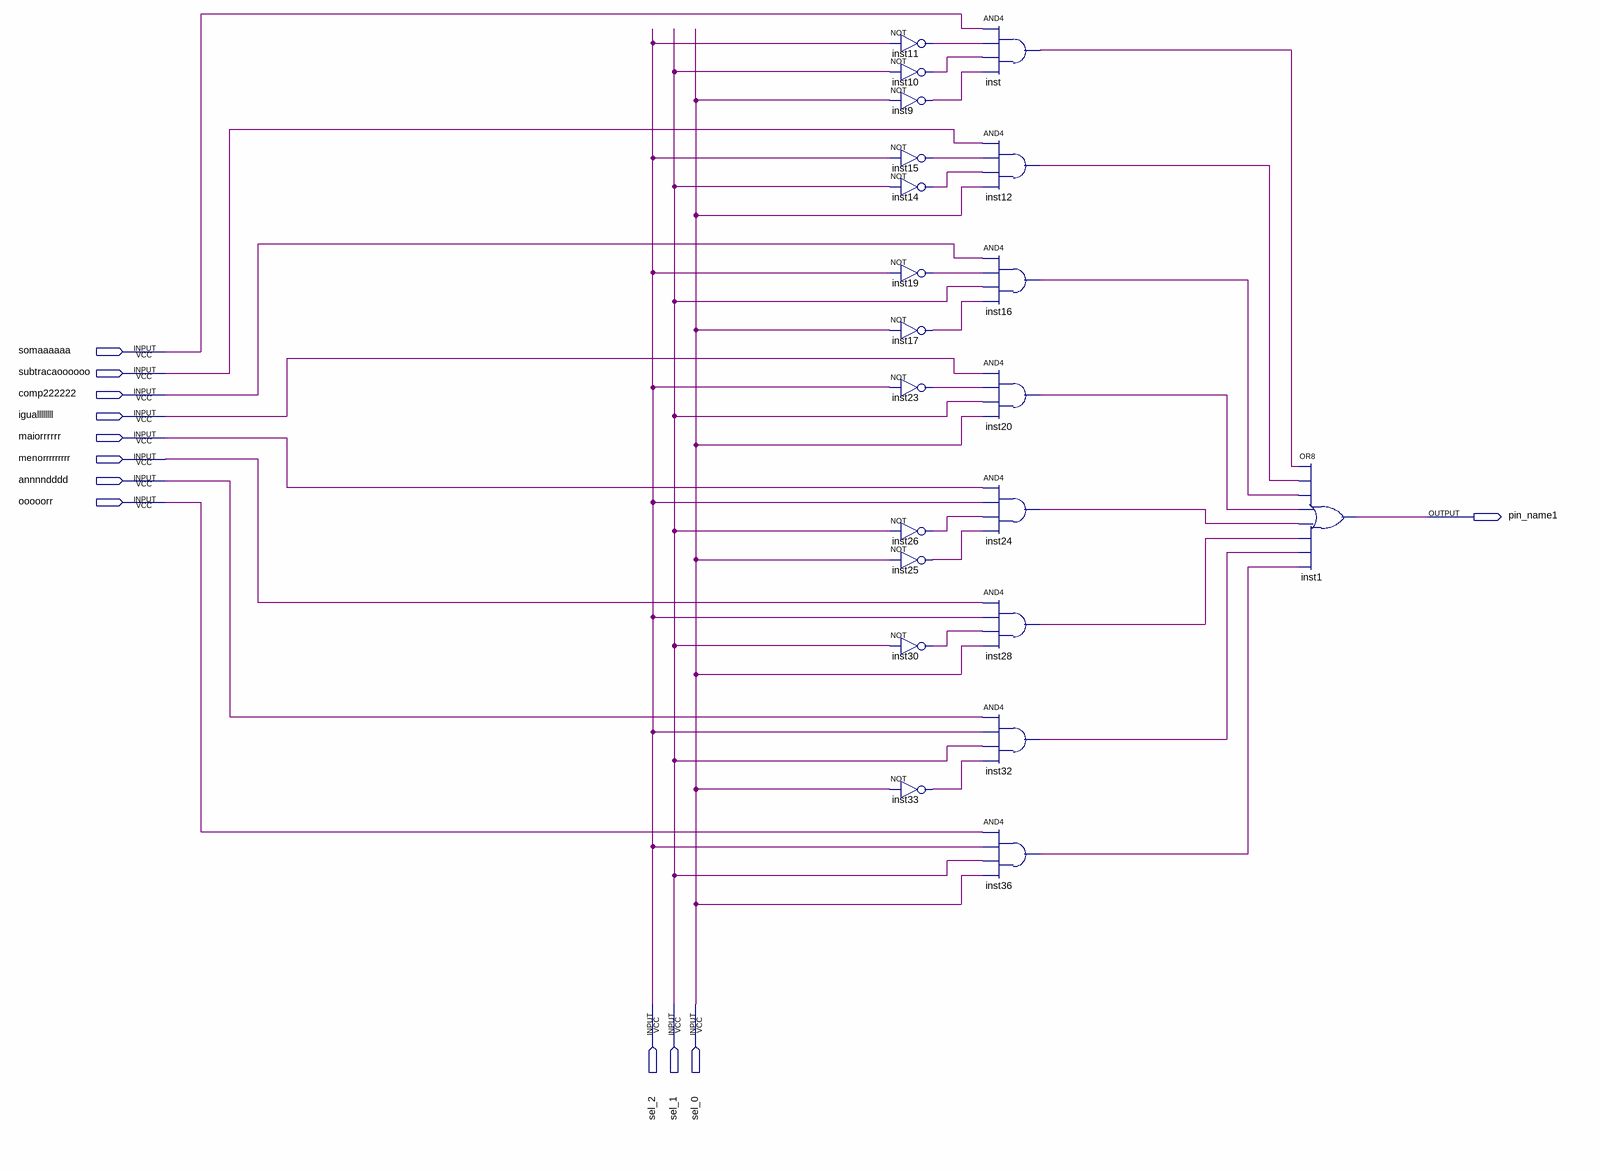
[diagram p0: schematic sheet]
// Quartus schematic mux.bdf as structural Verilog: 21 symbols, 12 pins
module mux (
  input  somaaaaaa,
  input  subtracaoooooo,
  input  comp222222,
  input  iguallllllll,
  input  maiorrrrrr,
  input  menorrrrrrrrr,
  input  annnndddd,
  input  ooooorr,
  input  sel_2,
  input  sel_1,
  input  sel_0,
  output pin_name1
);

  wire inst9_out, inst10_out, inst11_out, inst12_out, inst14_out, inst15_out, inst16_out, inst17_out,
       inst19_out, inst20_out, inst23_out, inst24_out, inst25_out, inst26_out, inst28_out, inst30_out,
       inst32_out, inst33_out, inst36_out, inst_out;

  not inst11 (inst11_out, sel_2);
  not inst10 (inst10_out, sel_1);
  not inst9 (inst9_out, sel_0);
  not inst15 (inst15_out, sel_2);
  not inst14 (inst14_out, sel_1);
  not inst19 (inst19_out, sel_2);
  not inst17 (inst17_out, sel_0);
  not inst23 (inst23_out, sel_2);
  not inst26 (inst26_out, sel_1);
  not inst25 (inst25_out, sel_0);
  not inst30 (inst30_out, sel_1);
  not inst33 (inst33_out, sel_0);
  and inst (inst_out, somaaaaaa, inst11_out, inst10_out, inst9_out);
  and inst12 (inst12_out, subtracaoooooo, inst15_out, inst14_out, sel_0);
  and inst16 (inst16_out, comp222222, inst19_out, sel_1, inst17_out);
  and inst20 (inst20_out, iguallllllll, inst23_out, sel_1, sel_0);
  and inst24 (inst24_out, maiorrrrrr, sel_2, inst26_out, inst25_out);
  and inst28 (inst28_out, menorrrrrrrrr, sel_2, inst30_out, sel_0);
  and inst32 (inst32_out, annnndddd, sel_2, sel_1, inst33_out);
  and inst36 (inst36_out, ooooorr, sel_2, sel_1, sel_0);
  or inst1 (pin_name1, inst_out, inst12_out, inst16_out, inst20_out, inst24_out, inst28_out, inst32_out, inst36_out);
endmodule
